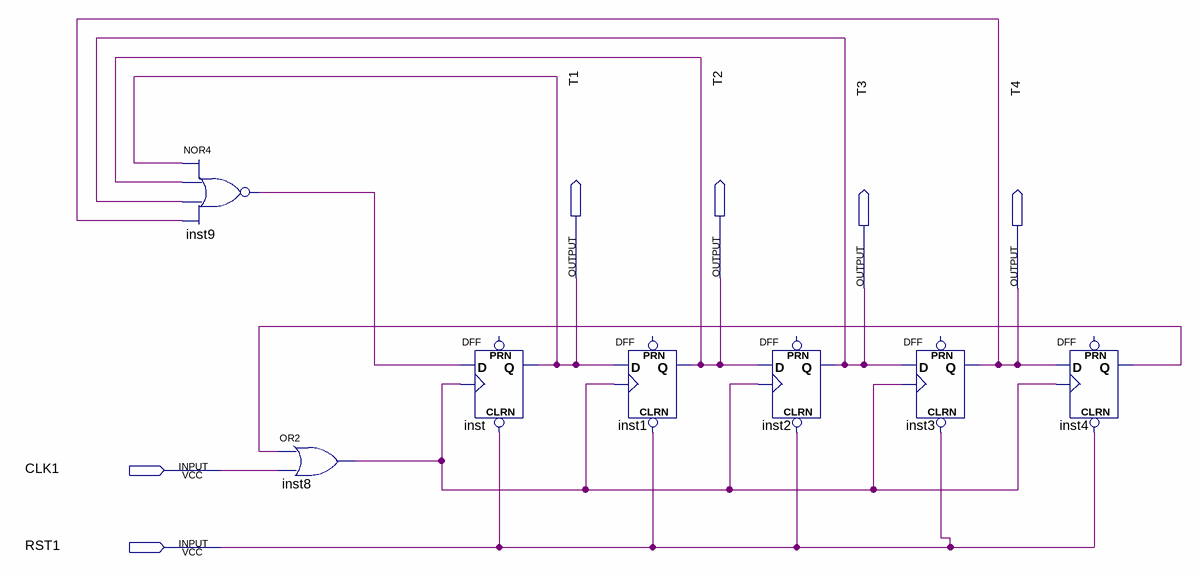
[diagram p0: schematic sheet]
// Quartus schematic 4223.bdf as structural Verilog: 7 symbols, 6 pins
module \4223  (
  input  CLK1,
  input  RST1,
  output T1,
  output T2,
  output T3,
  output T4
);

  wire inst4_q, inst8_out, inst9_out;

  nor inst9 (inst9_out, T1, T2, T3, T4);
  or inst8 (inst8_out, inst4_q, CLK1);
  DFF inst (.CLRN(RST1), .CLK(inst8_out), .D(inst9_out), .Q(T1));  // open: PRN
  DFF inst1 (.CLRN(RST1), .CLK(inst8_out), .D(T1), .Q(T2));  // open: PRN
  DFF inst2 (.CLRN(RST1), .CLK(inst8_out), .D(T2), .Q(T3));  // open: PRN
  DFF inst3 (.CLRN(RST1), .CLK(inst8_out), .D(T3), .Q(T4));  // open: PRN
  DFF inst4 (.CLRN(RST1), .CLK(inst8_out), .D(T4), .Q(inst4_q));  // open: PRN
endmodule
